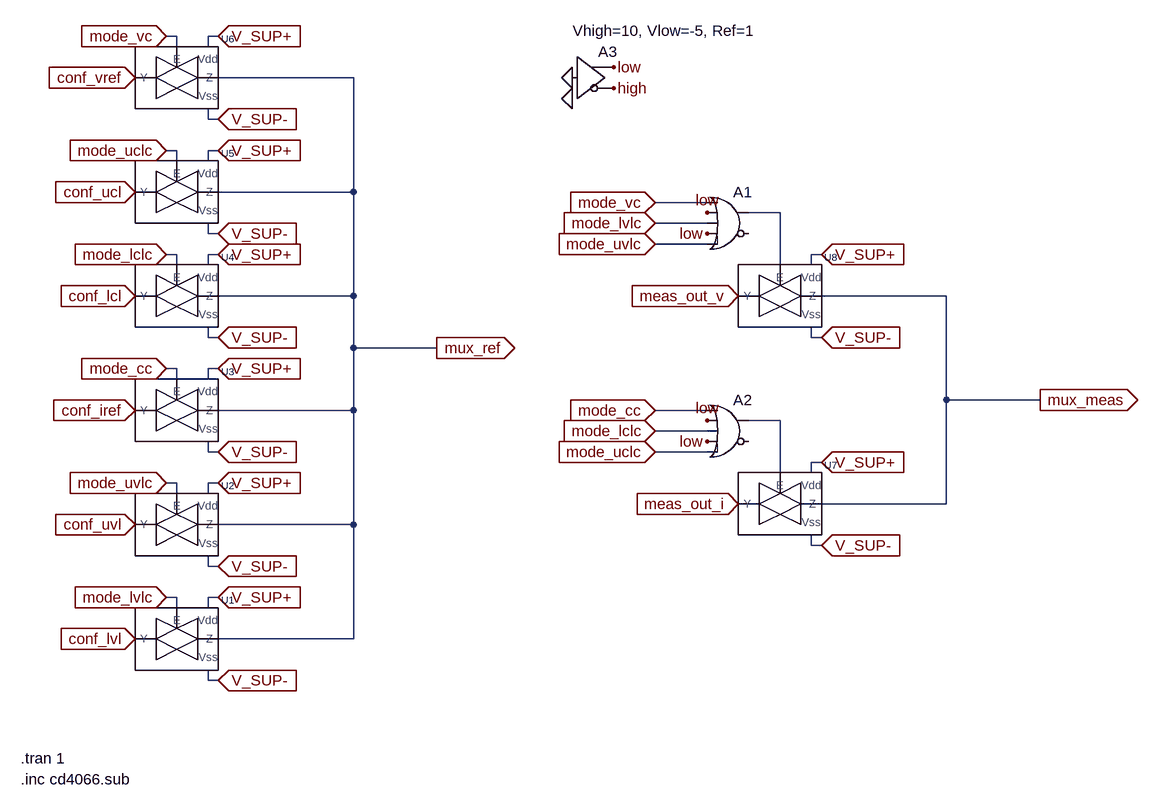
[diagram p0: schematic mux.asc]
mux.asc, the LTspice schematic file:
Version 4
SHEET 1 1704 680
WIRE 192 -768 176 -768
WIRE 256 -768 240 -768
WIRE 192 -752 192 -768
WIRE 240 -752 240 -768
WIRE 464 -704 256 -704
WIRE 240 -640 240 -656
WIRE 256 -640 240 -640
WIRE 192 -592 176 -592
WIRE 256 -592 240 -592
WIRE 192 -576 192 -592
WIRE 240 -576 240 -592
WIRE 464 -528 464 -704
WIRE 464 -528 256 -528
WIRE 1008 -512 928 -512
WIRE 1120 -496 1072 -496
WIRE 1008 -480 928 -480
WIRE 240 -464 240 -480
WIRE 256 -464 240 -464
WIRE 1008 -448 928 -448
WIRE 192 -432 176 -432
WIRE 256 -432 240 -432
WIRE 1184 -432 1168 -432
WIRE 192 -416 192 -432
WIRE 240 -416 240 -432
WIRE 1120 -416 1120 -496
WIRE 1168 -416 1168 -432
WIRE 464 -368 464 -528
WIRE 464 -368 256 -368
WIRE 1376 -368 1184 -368
WIRE 240 -304 240 -320
WIRE 256 -304 240 -304
WIRE 1168 -304 1168 -320
WIRE 1184 -304 1168 -304
WIRE 464 -288 464 -368
WIRE 592 -288 464 -288
WIRE 192 -256 176 -256
WIRE 256 -256 240 -256
WIRE 192 -240 192 -256
WIRE 240 -240 240 -256
WIRE 1376 -208 1376 -368
WIRE 1520 -208 1376 -208
WIRE 464 -192 464 -288
WIRE 464 -192 256 -192
WIRE 1008 -192 928 -192
WIRE 1120 -176 1072 -176
WIRE 1008 -160 928 -160
WIRE 240 -128 240 -144
WIRE 256 -128 240 -128
WIRE 1008 -128 928 -128
WIRE 1184 -112 1168 -112
WIRE 1120 -96 1120 -176
WIRE 1168 -96 1168 -112
WIRE 192 -80 176 -80
WIRE 256 -80 240 -80
WIRE 192 -64 192 -80
WIRE 240 -64 240 -80
WIRE 1376 -48 1376 -208
WIRE 1376 -48 1184 -48
WIRE 464 -16 464 -192
WIRE 464 -16 256 -16
WIRE 1168 16 1168 0
WIRE 1184 16 1168 16
WIRE 240 48 240 32
WIRE 256 48 240 48
WIRE 192 96 176 96
WIRE 256 96 240 96
WIRE 192 112 192 96
WIRE 240 112 240 96
WIRE 464 160 464 -16
WIRE 464 160 256 160
WIRE 240 224 240 208
WIRE 256 224 240 224
FLAG 256 96 V_SUP+
IOPIN 256 96 In
FLAG 256 224 V_SUP-
IOPIN 256 224 In
FLAG 256 -80 V_SUP+
IOPIN 256 -80 In
FLAG 256 48 V_SUP-
IOPIN 256 48 In
FLAG 256 -256 V_SUP+
IOPIN 256 -256 In
FLAG 256 -128 V_SUP-
IOPIN 256 -128 In
FLAG 256 -432 V_SUP+
IOPIN 256 -432 In
FLAG 256 -304 V_SUP-
IOPIN 256 -304 In
FLAG 256 -592 V_SUP+
IOPIN 256 -592 In
FLAG 256 -464 V_SUP-
IOPIN 256 -464 In
FLAG 256 -768 V_SUP+
IOPIN 256 -768 In
FLAG 256 -640 V_SUP-
IOPIN 256 -640 In
FLAG 1184 -112 V_SUP+
IOPIN 1184 -112 In
FLAG 1184 16 V_SUP-
IOPIN 1184 16 In
FLAG 1184 -432 V_SUP+
IOPIN 1184 -432 In
FLAG 1184 -304 V_SUP-
IOPIN 1184 -304 In
FLAG 176 -768 mode_vc
IOPIN 176 -768 In
FLAG 176 -592 mode_uclc
IOPIN 176 -592 In
FLAG 176 -432 mode_lclc
IOPIN 176 -432 In
FLAG 176 -256 mode_cc
IOPIN 176 -256 In
FLAG 176 -80 mode_uvlc
IOPIN 176 -80 In
FLAG 176 96 mode_lvlc
IOPIN 176 96 In
FLAG 128 -704 conf_vref
IOPIN 128 -704 In
FLAG 128 -528 conf_ucl
IOPIN 128 -528 In
FLAG 128 -368 conf_lcl
IOPIN 128 -368 In
FLAG 128 -192 conf_iref
IOPIN 128 -192 In
FLAG 128 -16 conf_uvl
IOPIN 128 -16 In
FLAG 128 160 conf_lvl
IOPIN 128 160 In
FLAG 592 -288 mux_ref
IOPIN 592 -288 Out
FLAG 1056 -368 meas_out_v
IOPIN 1056 -368 In
FLAG 1056 -48 meas_out_i
IOPIN 1056 -48 In
FLAG 928 -512 mode_vc
IOPIN 928 -512 In
FLAG 928 -160 mode_lclc
IOPIN 928 -160 In
FLAG 928 -128 mode_uclc
IOPIN 928 -128 In
FLAG 928 -192 mode_cc
IOPIN 928 -192 In
FLAG 928 -480 mode_lvlc
IOPIN 928 -480 In
FLAG 928 -448 mode_uvlc
IOPIN 928 -448 In
FLAG 1008 -496 low
FLAG 1008 -464 low
FLAG 1008 -176 low
FLAG 1008 -144 low
FLAG 1520 -208 mux_meas
IOPIN 1520 -208 Out
FLAG 800 -672 0
FLAG 800 -704 0
FLAG 864 -688 high
FLAG 864 -720 low
SYMBOL cd4066 192 160 R0
SYMATTR InstName U1
SYMBOL cd4066 192 -16 R0
SYMATTR InstName U2
SYMBOL cd4066 192 -192 R0
SYMATTR InstName U3
SYMBOL cd4066 192 -368 R0
SYMATTR InstName U4
SYMBOL cd4066 192 -528 R0
SYMATTR InstName U5
SYMBOL cd4066 192 -704 R0
SYMATTR InstName U6
SYMBOL cd4066 1120 -48 R0
SYMATTR InstName U7
SYMBOL cd4066 1120 -368 R0
SYMATTR InstName U8
SYMBOL Digital\\or 1040 -544 R0
SYMATTR SpiceLine Vhigh=10, Vlow=-5, Trise=60n, Tfall=60n, Td=30n
SYMATTR InstName A1
SYMBOL Digital\\or 1040 -224 R0
SYMATTR SpiceLine Vhigh=10, Vlow=-5, Trise=60n, Tfall=60n, Td=30n
SYMATTR InstName A2
SYMBOL Digital\\buf 800 -768 R0
WINDOW 39 1 -8 Left 2
SYMATTR SpiceLine Vhigh=10, Vlow=-5, Ref=1
SYMATTR InstName A3
TEXT -48 344 Left 2 !.tran 1
TEXT -48 376 Left 2 !.inc cd4066.sub

The netlist it stands for:
* mux.asc
XU1 mode_lvlc conf_lvl mux_ref V_SUP+ V_SUP- CD4066  ; pins E Y Z Vdd Vss
XU2 mode_uvlc conf_uvl mux_ref V_SUP+ V_SUP- CD4066  ; pins E Y Z Vdd Vss
XU3 mode_cc conf_iref mux_ref V_SUP+ V_SUP- CD4066  ; pins E Y Z Vdd Vss
XU4 mode_lclc conf_lcl mux_ref V_SUP+ V_SUP- CD4066  ; pins E Y Z Vdd Vss
XU5 mode_uclc conf_ucl mux_ref V_SUP+ V_SUP- CD4066  ; pins E Y Z Vdd Vss
XU6 mode_vc conf_vref mux_ref V_SUP+ V_SUP- CD4066  ; pins E Y Z Vdd Vss
XU7 N002 meas_out_i mux_meas V_SUP+ V_SUP- CD4066  ; pins E Y Z Vdd Vss
XU8 N001 meas_out_v mux_meas V_SUP+ V_SUP- CD4066  ; pins E Y Z Vdd Vss
A1 mode_vc low mode_lvlc low mode_uvlc 0 N001 0 OR Vhigh=10, Vlow=-5, Trise=60n, Tfall=60n, Td=30n
A2 mode_cc low mode_lclc low mode_uclc 0 N002 0 OR Vhigh=10, Vlow=-5, Trise=60n, Tfall=60n, Td=30n
A3 0 0 0 0 0 high low 0 BUF Vhigh=10, Vlow=-5, Ref=1
.tran 1
.inc cd4066.sub
.backanno
.end